# Altium schematic sheet POWER.SchDoc
size A4
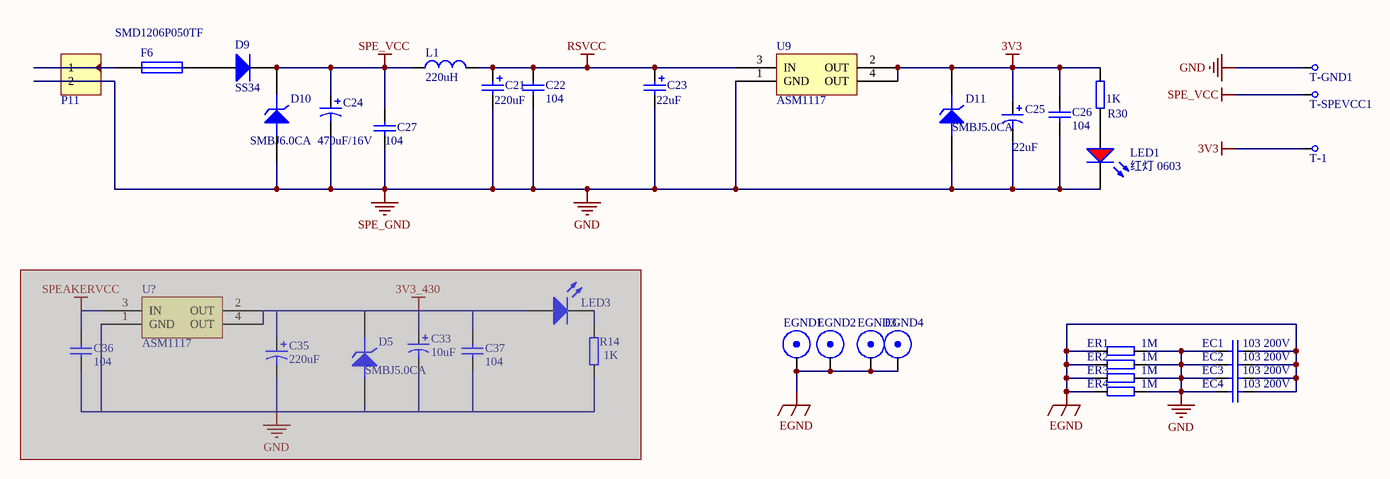
[diagram p0: POWER.SchDoc]

## Parts
C21  220uF  [C-RB-SD8]
C22  104  [LC-0603_C]
C23  22uF  [C-RB-SD6]
C24  470uF/16V  [C-RB-SD8]
C25  22uF  [HONOR_63X54]
C26  104  [LC-0603_C]
C27  104  [LC-0603_C]
C33  10uF  [HONOR_63X54]  (masked out: inside a compile mask, not in the netlist)
C35  220uF  [C-RB-SD8]  (masked out: inside a compile mask, not in the netlist)
C36  104  [LC-0603_C]  (masked out: inside a compile mask, not in the netlist)
C37  104  [LC-0603_C]  (masked out: inside a compile mask, not in the netlist)
D5  SMBJ5.0CA  [LC-SMB(DO-214AA)_S1]  (masked out: inside a compile mask, not in the netlist)
D9  SS34  [LC-SMA(DO-214AC)_S5]
D10  SMBJ6.0CA  [LC-SMB(DO-214AA)_S1]
D11  SMBJ5.0CA  [LC-SMB(DO-214AA)_S1]
EC1  103 200V  [LC-1206_C]
EC2  103 200V  [LC-1206_C]
EC3  103 200V  [LC-1206_C]
EC4  103 200V  [LC-1206_C]
EGND1  EGND  [H-6-3.2m]  (value not drawn)
EGND2  EGND  [H-6-3.2m]  (value not drawn)
EGND3  EGND  [H-6-3.2m]  (value not drawn)
EGND4  EGND  [H-6-3.2m]  (value not drawn)
ER1  1M  [LC-1206_R]
ER2  1M  [LC-1206_R]
ER3  1M  [LC-1206_R]
ER4  1M  [LC-1206_R]
F6  SMD1206P050TF  [LC-1206_R]
L1  value 220uH  [L-SMD-7]  (hidden comment: Inductor)
LED1  红灯 0603  [LC-0603_LED_S1]
LED3  LED0  [LC-0603_LED_S1]  (value not drawn)  (masked out: inside a compile mask, not in the netlist)
P11  Header 2  [D5.08-2P]  (value not drawn)
R14  1K  [LC-0603_R]  (masked out: inside a compile mask, not in the netlist)
R30  1K  [LC-0603_R]
T-1  CHECK  [CHECK-B]  (value not drawn)
T-GND1  CHECK  [CHECK-B]  (value not drawn)
T-SPEVCC1  CHECK  [CHECK-B]  (value not drawn)
U9  ASM1117  [SOT223]
U?  ASM1117  [SOT223]  (masked out: inside a compile mask, not in the netlist)

## Nets
3V3: C25.1 C26.2 D11.2(K) R30.2 T-1.1 U9.2(OUT) U9.4(OUT)
EGND: EC1.1 EC2.1 EC3.1 EC4.1 EGND1.0 EGND2.0 EGND3.0 EGND4.0 ER1.1 ER2.1 ER3.1 ER4.1
GND: C21.2 C22.1 C23.2 C24.2 C25.2 C26.1 C27.2 D10.1(A) D11.1(A) EC1.2 EC2.2 EC3.2 EC4.2 ER1.2 ER2.2 ER3.2 ER4.2 LED1.K P11.2 T-GND1.1 U9.1(GND)  [also labelled SPE_GND]
RSVCC: C21.1 C22.2 C23.1 L1.2 U9.3(IN)
SPE_VCC: C24.1 C27.1 D9.2(K) D10.2(K) L1.1 T-SPEVCC1.1
NetD9_1: D9.1(A) F6.2
NetF6_1: F6.1 P11.1
NetLED1_A: LED1.A R30.1

## Library data of the parts
C21 = Cap Pol1: Polarized Capacitor (Radial); Value: 22uF; Published: 8-Jun-2000; Revision: July-2002: Re-released for DXP Platform.; Publisher: Altium Limited
C22 C26 C36 C37 = Cap: Capacitor; Published: 8-Jun-2000; LatestRevisionDate: 17-Jul-2002; LatestRevisionNote: Re-released for DXP Platform.; PackageReference: RAD-0.3; Publisher: Altium Limited; Value: 104
C23 = Cap Pol1: Polarized Capacitor (Radial); Published: 8-Jun-2000; Revision: July-2002: Re-released for DXP Platform.; Publisher: Altium Limited; Value: 22uF
C24 = Cap Pol3: Polarized Capacitor (Surface Mount); Value: 470uF; Published: 8-Jun-2000; LatestRevisionDate: 17-Jul-2002; LatestRevisionNote: Re-released for DXP Platform.; PackageReference: C0805; Publisher: Altium Limited
C25 = Cap Pol3: Polarized Capacitor (Surface Mount); Value: 10uF; Published: 8-Jun-2000; LatestRevisionDate: 17-Jul-2002; LatestRevisionNote: Re-released for DXP Platform.; PackageReference: C0805; Publisher: Altium Limited
C27 = Cap: Capacitor; Value: 100nF; Published: 8-Jun-2000; Revision: July-2002: Re-released for DXP Platform.; Publisher: Altium Limited
C33 C35 = Cap Pol3: Polarized Capacitor (Surface Mount); Published: 8-Jun-2000; LatestRevisionDate: 17-Jul-2002; LatestRevisionNote: Re-released for DXP Platform.; PackageReference: C0805; Publisher: Altium Limited
  C33: Value: 10uF
  C35: Value: 220uF
D5 D10 D11 = ZENER3: Zener Diode
D9 = Diode: Default Diode; Published: 8-Jun-2000; LatestRevisionDate: 17-Jul-2002; LatestRevisionNote: Re-released for DXP Platform.; PackageDocument: Sep-1996; PackageReference: SMC; Publisher: Altium Limited; Code_JEDEC: DO-214-AB
EC1-EC4 = Cap: Capacitor; Value: 103; Published: 8-Jun-2000; Revision: July-2002: Re-released for DXP Platform.; Publisher: Altium Limited
ER1-ER4 R14 R30 = RES2
F6 = Fuse 1: Fuse; Published: 8-Jun-2000; LatestRevisionDate: 17-Jul-2002; LatestRevisionNote: Re-released for DXP Platform.; PackageReference: PIN-W2/E2.8; Publisher: Altium Limited
L1 = Inducto: 电感; Code_IEC: 1005; Published: 8-Jun-2000; LatestRevisionDate: 17-Jul-2002; LatestRevisionNote: Re-released for DXP Platform.; PackageReference: 0402-A; Publisher: Altium Limited; Code_JEITA: 0402
LED1 = 0: 发光二极管; ComponentLink1Description: 供应商链接; ComponentLink1URL: http://www.szlcsc.com/product/details_2659.html; Package: 0603; Supplier: LC; SuppliersPartNumber: C2286
LED3 = LED0: Typical INFRARED GaAs LED; Published: 8-Jun-2000; LatestRevisionDate: 08-Jul-2005; LatestRevisionNote: Mech Layer 1 removed.; PackageReference: LED-0; Publisher: Altium Limited
P11 = Head: 接插件; LatestRevisionDate: 17-Jul-2002; LatestRevisionNote: Re-released for DXP Platform.; Publisher: Altium Limited
T-1 T-GND1 T-SPEVCC1 = CHE: 测试点
U9 U? = ASM1: 3.3V稳压芯片